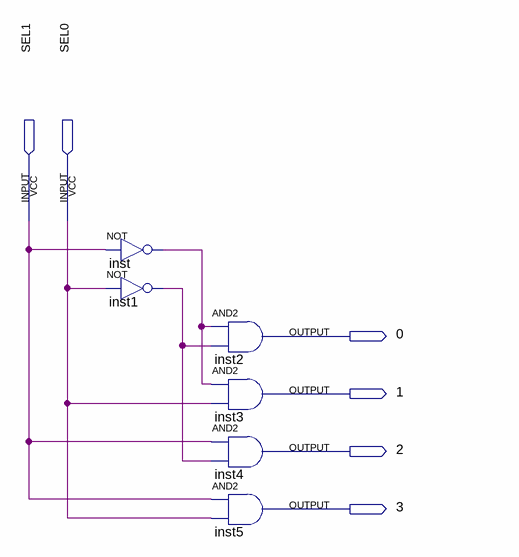
[diagram p0: schematic sheet]
// Quartus schematic 2Bit-Decoder.bdf as structural Verilog: 6 symbols, 6 pins
module \2Bit-Decoder  (
  input  SEL1,
  input  SEL0,
  output \0 ,
  output \1 ,
  output \2 ,
  output \3 
);

  wire inst1_out, inst_out;

  not inst (inst_out, SEL1);
  not inst1 (inst1_out, SEL0);
  and inst2 (\0 , inst_out, inst1_out);
  and inst3 (\1 , inst_out, SEL0);
  and inst4 (\2 , SEL1, inst1_out);
  and inst5 (\3 , SEL1, SEL0);
endmodule
